# EAGLE design trinket-mcp23016 (EAGLE 9.6.2)
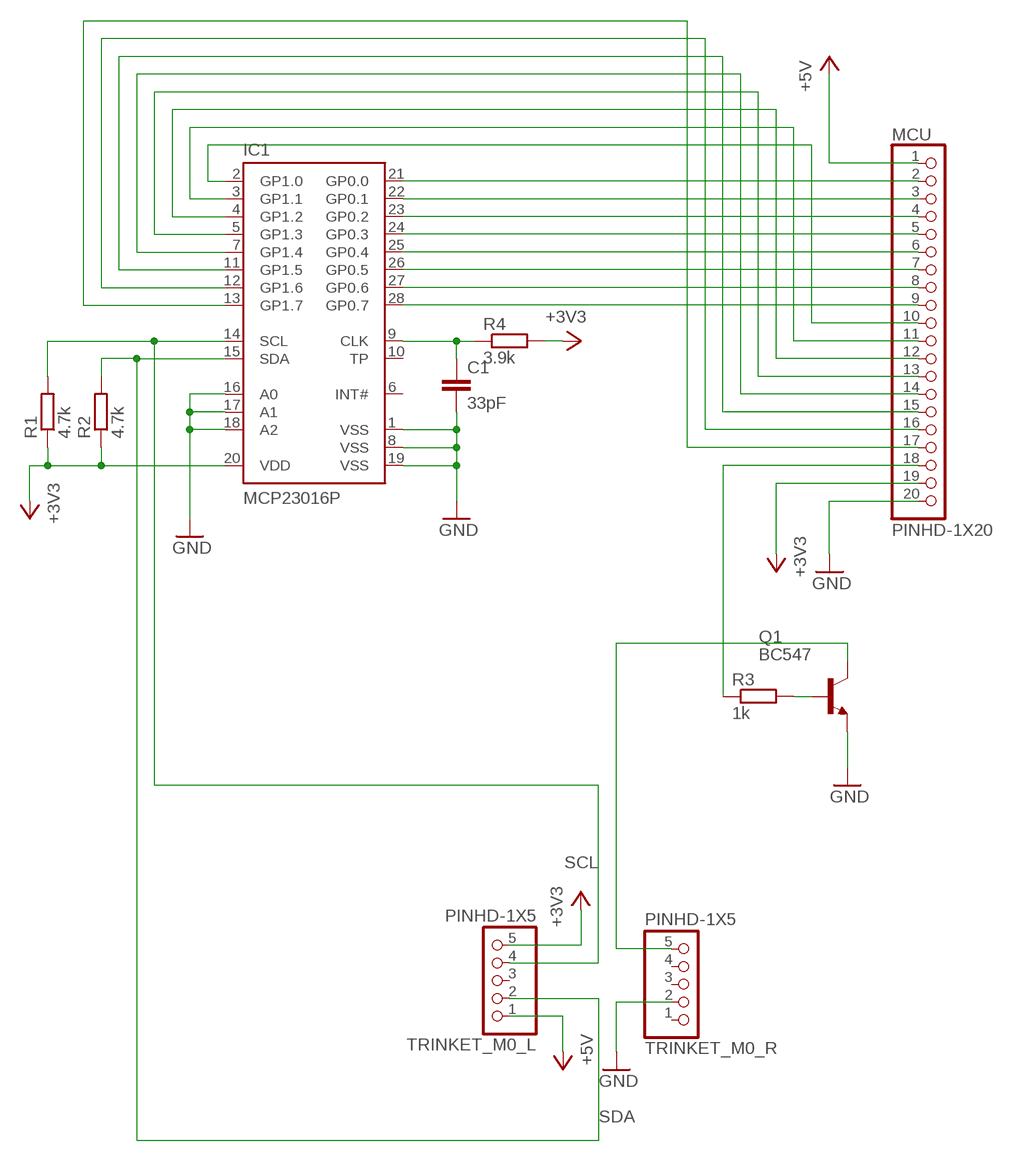
[diagram p0: schematic, sheet 1]

## Parts
C1  33pF  C-EU025-025X050  [C025-025X050]
IC1  MCP23016P  [DIL28-3]
MCU  PINHD-1X20  [1X20]
Q1  BC547  [TO92]
R1  4.7k  R-EU_0207/10  [0207/10]
R2  4.7k  R-EU_0207/10  [0207/10]
R3  1k  R-EU_0207/10  [0207/10]
R4  3.9k  R-EU_0207/10  [0207/10]
TRINKET_M0_L  PINHD-1X5  [1X05]
TRINKET_M0_R  PINHD-1X5  [1X05]

## Nets
+3V3: IC1.20(VDD) MCU.19 R1.1 R2.1 R4.2 TRINKET_M0_L.5
+5V: MCU.1 TRINKET_M0_L.1
GND: C1.2 IC1.1(VSS) IC1.8(VSS) IC1.16(A0) IC1.17(A1) IC1.18(A2) IC1.19(VSS) MCU.20 Q1.1(E) TRINKET_M0_R.2
N$1: IC1.21(GP0.0) MCU.2
N$2: IC1.22(GP0.1) MCU.3
N$3: IC1.23(GP0.2) MCU.4
N$4: IC1.24(GP0.3) MCU.5
N$5: IC1.25(GP0.4) MCU.6
N$6: IC1.26(GP0.5) MCU.7
N$7: IC1.27(GP0.6) MCU.8
N$8: IC1.28(GP0.7) MCU.9
N$9: IC1.2(GP1.0) MCU.10
N$10: IC1.3(GP1.1) MCU.11
N$11: IC1.4(GP1.2) MCU.12
N$12: IC1.5(GP1.3) MCU.13
N$13: IC1.7(GP1.4) MCU.14
N$14: IC1.11(GP1.5) MCU.15
N$15: IC1.12(GP1.6) MCU.16
N$16: IC1.13(GP1.7) MCU.17
N$17: Q1.2(B) R3.2
N$18: MCU.18 R3.1
N$19: Q1.3(C) TRINKET_M0_R.5
N$20: C1.1 IC1.9(CLK) R4.1
SCL: IC1.14(SCL) R1.2 TRINKET_M0_L.4
SDA: IC1.15(SDA) R2.2 TRINKET_M0_L.2
Unconnected: IC1.6(INT#) IC1.10(TP) TRINKET_M0_L.3 TRINKET_M0_R.1 TRINKET_M0_R.3 TRINKET_M0_R.4

## Library data of the parts
C1 = rcl:C-EU: CAPACITOR, European symbol; SPICEPREFIX: C
IC1 = microchip-dspic:MCP23016: 16-Bit I/O Expander with I2C Interface
MCU = Connector:PINHD-1X20: PIN HEADER; CATEGORY: CONNECTOR; SUB-CATEGORY: PIN-HEADER
Q1 = transistor-npn:BC547*: NPN Transistor
R1-R4 = rcl:R-EU_: RESISTOR, European symbol; SPICEPREFIX: R
TRINKET_M0_L TRINKET_M0_R = Connector:PINHD-1X5: PIN HEADER; CATEGORY: CONNECTOR; SUB-CATEGORY: PIN-HEADER

## Board
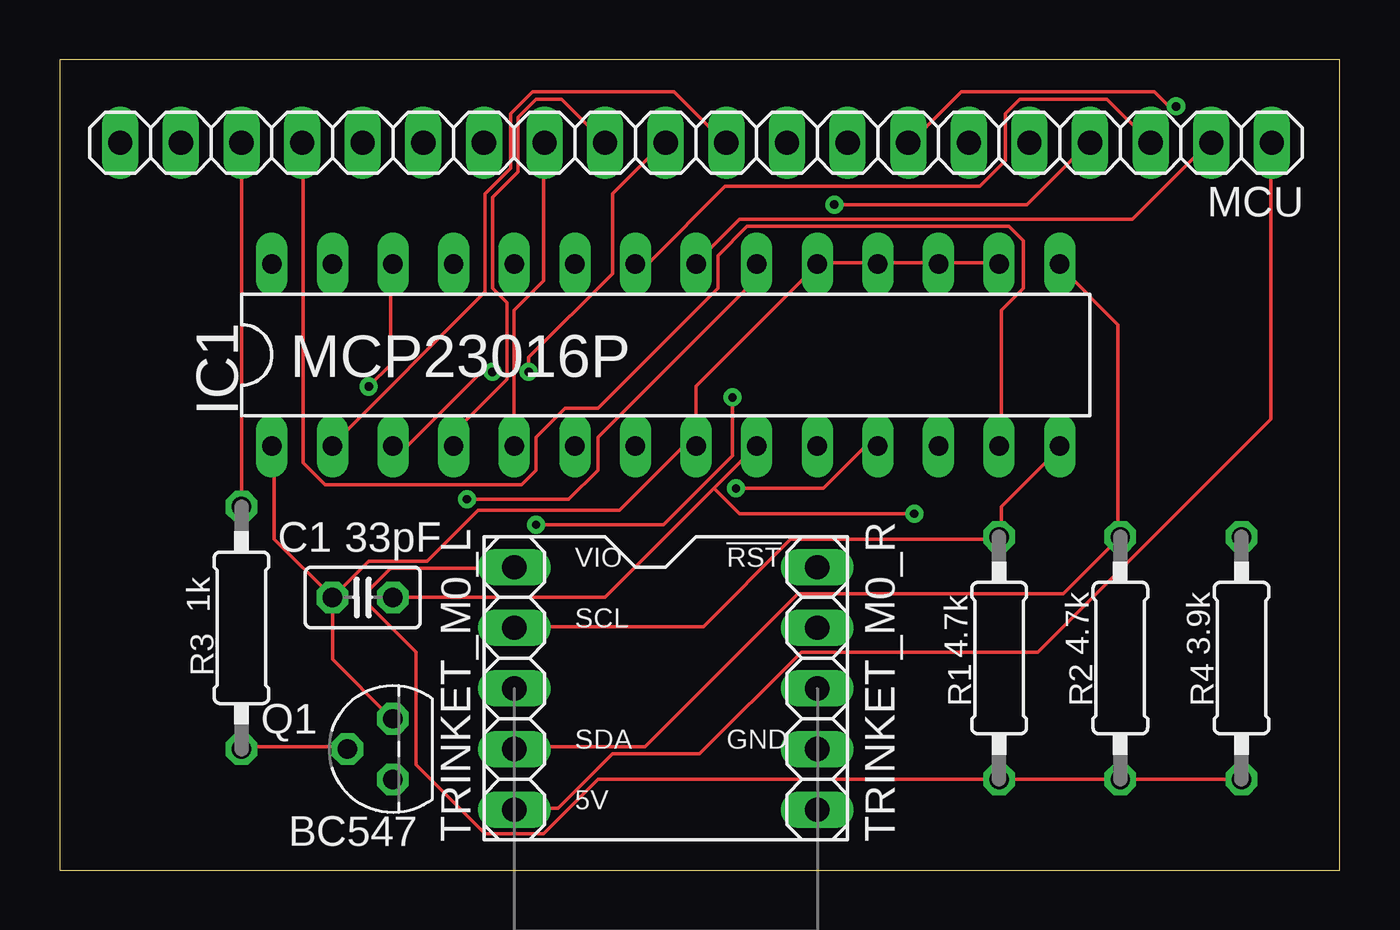
[diagram p1: board, top side]
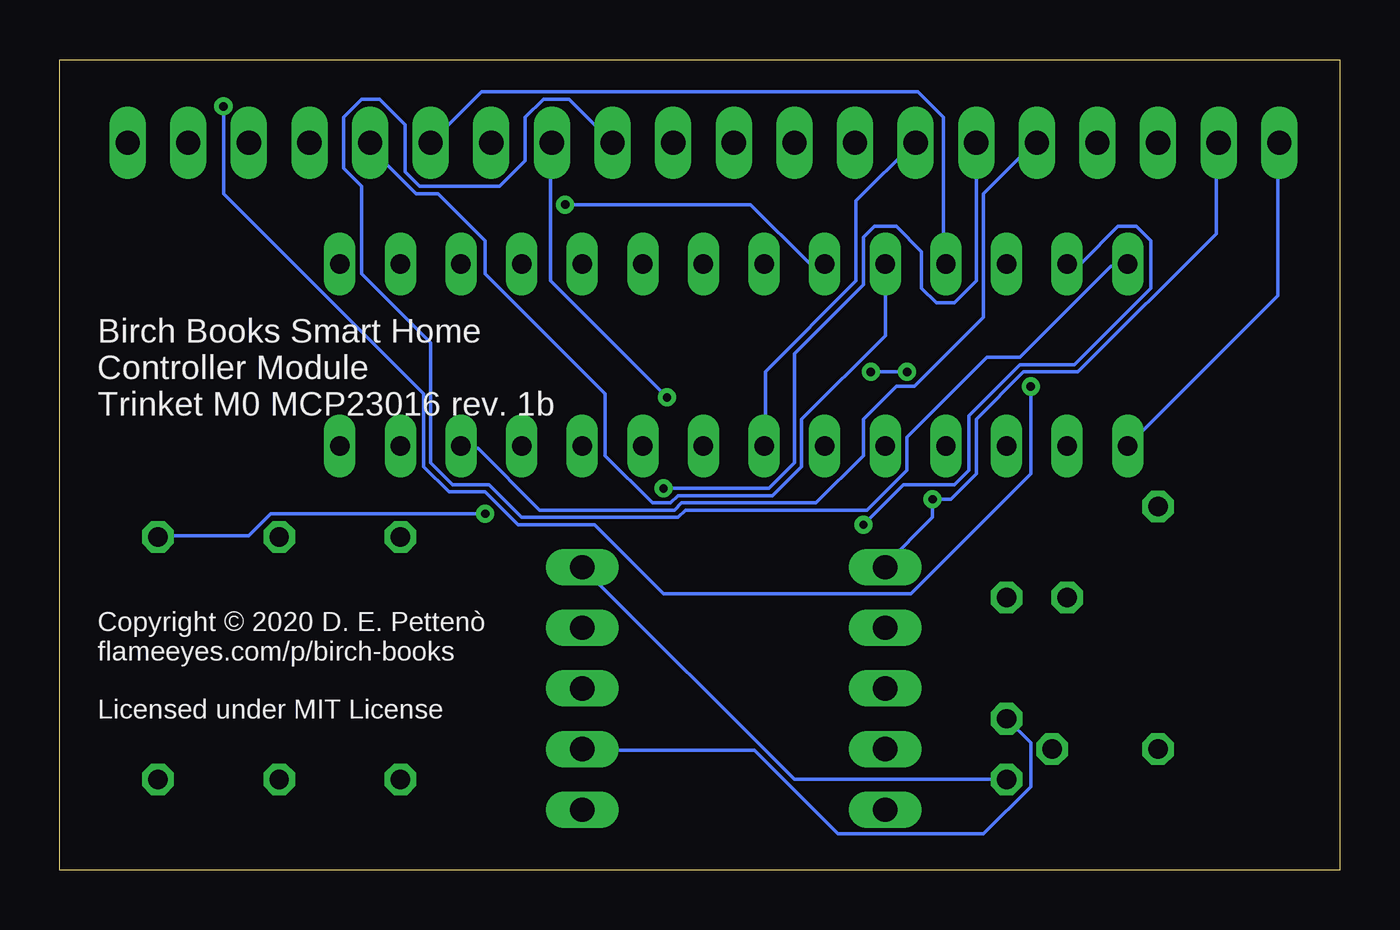
[diagram p2: board, bottom side, seen from below]

Size 53.65 x 33.96 mm. Coordinates in mm from the lower left corner, seen from the top.
Outline: 0,0 53.65,0 53.65,33.96 0,33.96 0,0
Copper layers (1*16): Top 0.035mm / dielectric 1.5mm / Bottom 0.035mm
Design rules "default": minimum track width 6mil, minimum drill 0.35mm, track to track 6mil, track to pad 6mil, pad to pad 6mil, via to via 6mil, smd to smd 6mil, copper to edge 40mil, drill to drill 6mil, minimum pad ring 10mil, minimum via ring 8mil, stop-mask expansion 4mil, vias tented up to drill 0mil, thermal gap 10mil

### Footprints (pad centres in the part's own frame; a part is rotated, then mirrored left to right if it is on the bottom)
C025-025X050 = drill 0.813 octagon: 1 -1.27,0; 2 1.27,0
DIL28-3 = drill 0.813 long: 1 -16.51,-3.81; 2 -13.97,-3.81; 3 -11.43,-3.81; 4 -8.89,-3.81; 5 -6.35,-3.81; 6 -3.81,-3.81; 7 -1.27,-3.81; 8 1.27,-3.81; 9 3.81,-3.81; 10 6.35,-3.81; 11 8.89,-3.81; 12 11.43,-3.81; 13 13.97,-3.81; 14 16.51,-3.81; 15 16.51,3.81; 16 13.97,3.81; 17 11.43,3.81; 18 8.89,3.81; 19 6.35,3.81; 20 3.81,3.81; 21 1.27,3.81; 22 -1.27,3.81; 23 -3.81,3.81; 24 -6.35,3.81; 25 -8.89,3.81; 26 -11.43,3.81; 27 -13.97,3.81; 28 -16.51,3.81
1X20 = drill 1.016 long: 1 -24.13,0; 2 -21.59,0; 3 -19.05,0; 4 -16.51,0; 5 -13.97,0; 6 -11.43,0; 7 -8.89,0; 8 -6.35,0; 9 -3.81,0; 10 -1.27,0; 11 1.27,0; 12 3.81,0; 13 6.35,0; 14 8.89,0; 15 11.43,0; 16 13.97,0; 17 16.51,0; 18 19.05,0; 19 21.59,0; 20 24.13,0
TO92 = drill 0.813 octagon: 1 1.27,0; 2 0,1.905; 3 -1.27,0
0207/10 = drill 0.813 octagon: 1 -5.08,0; 2 5.08,0
1X05 = drill 1.016 long: 1 -5.08,0; 2 -2.54,0; 3 0,0; 4 2.54,0; 5 5.08,0

### Placement (x,y rotation side)
C1  12.7,11.43 180 top
IC1  25.4,21.59 0 top
MCU  26.67,30.48 180 top
Q1  13.97,5.08 90 top
R1  39.37,8.89 90 top
R2  44.45,8.89 90 top
R3  7.62,10.16 270 top
R4  49.53,8.89 270 top
TRINKET_M0_L  19.05,7.62 90 top
TRINKET_M0_R  31.75,7.62 90 top

### Tracks (layer width: path | path; a pad name or v marks a point on that pad's centre or on a via)
+3V3  (via drill 0.35)
  Top 0.152: R4.2 R2.1 R1.1 22.55,3.81 20.27,1.52 17.83,1.52 14.94,4.42 14.94,9.14 12.95,11.12 12.95,11.73 13.87,12.65 19.05,12.65 TRINKET_M0_L.5 | v17.07,15.54 21.34,15.54 22.55,16.76 22.55,18.14 29.11,24.69 29.11,25.3 IC1.20
  Bottom 0.152: TRINKET_M0_L.5 19.05,12.8 17.07,14.78 v17.07,15.54 16.31,15.54 15.24,16.61 15.24,18.9 13.26,20.88 10.97,20.88 5.18,26.67 5.18,30.48 MCU.19
+5V
  Top 0.152: TRINKET_M0_L.1 19.05,2.59 20.88,2.59 23.16,4.88 26.82,4.88 31.09,9.14 41,9.14 50.75,18.9 50.75,30.48 MCU.1
GND
  Top 0.152: IC1.16 39.32,25.45 36.88,25.45 IC1.17 36.73,25.45 34.29,25.45 | 34.29,25.45 31.85,25.45 IC1.19 31.7,25.3 26.67,20.27 IC1.8 26.67,17.68 26.06,17.68 23.47,15.09 17.53,15.09 15.39,12.95 12.95,12.95 C1.2 | 34.29,25.45 IC1.18 | C1.2 11.43,8.84 13.87,6.4 Q1.1 | C1.2 8.99,13.87 8.99,17.68 IC1.1
  Bottom 0.152: IC1.1 2.59,24.08 2.59,30.48 MCU.20 | Q1.1 12.95,5.33 12.95,3.5 14.94,1.52 21.03,1.52 24.54,5.03 31.7,5.03 TRINKET_M0_R.2
N$1
  Top 0.152: IC1.21 26.67,25.45 28.5,27.28 44.96,27.28 48.16,30.48 MCU.2
N$2
  Top 0.152: MCU.3 43.89,32.31 40.23,32.31 39.62,31.7 39.62,29.72 38.56,28.65 27.89,28.65 24.69,25.45 24.23,25.45 IC1.22
N$3  (via drill 0.35)
  Top 0.152: v32.46,27.89 40.54,27.89 43.13,30.48 MCU.4
  Bottom 0.152: v32.46,27.89 24.69,27.89 22.25,25.45 21.64,25.45 IC1.23
N$4
  Bottom 0.152: IC1.24 19.05,22.4 22.55,18.9 22.55,16.92 23.77,15.7 27.74,15.7 28.04,15.39 28.8,15.39 30.79,17.37 30.79,19.96 35.81,24.99 35.81,26.36 37.8,28.35 38.71,28.35 40.54,30.18 40.54,30.48 MCU.5
N$5
  Bottom 0.152: MCU.6 35.97,32.61 17.68,32.61 16.61,31.55 16.61,25.45 IC1.25
N$6  (via drill 0.35)
  Top 0.152: v12.95,20.27 13.87,21.18 13.87,25.3 IC1.26 | v46.79,32 46.48,32 45.87,32.61 37.8,32.61 35.66,30.48 MCU.7
  Bottom 0.152: v12.95,20.27 12.95,16.61 17.98,11.58 28.35,11.58 31.24,14.48 34.44,14.48 35.81,15.85 37.34,15.85 38.41,16.92 38.41,19.96 46.79,28.35 v46.79,32
N$7  (via drill 0.35)
  Top 0.152: v19.96,14.48 25.3,14.48 28.19,17.37 v28.19,19.81
  Bottom 0.152: v19.96,14.48 18.29,16.15 16.15,16.15 15.54,16.76 15.54,19.05 13.41,21.18 11.12,21.18 7.92,24.38 7.92,26.36 8.53,26.98 9.3,26.98 10.82,25.45 11.43,25.45 IC1.27 | v28.19,19.81 33.07,24.69 33.07,30.48 MCU.8
N$8
  Bottom 0.152: MCU.9 32.31,32.31 33.38,32.31 34.14,31.55 34.14,29.72 35.2,28.65 38.56,28.65 39.17,29.26 39.17,31.24 40.23,32.31 41,32.31 41.76,31.55 41.76,29.41 41,28.65 41,24.99 38.1,22.1 38.1,17.07 37.19,16.15 35.66,16.15 34.29,14.78 27.74,14.78 27.43,15.09 19.81,15.09 18.14,16.76 18.14,18.14 14.78,21.49 13.41,21.49 9.6,25.3 8.99,25.3 IC1.28
N$9
  Top 0.152: IC1.2 11.43,17.83 17.83,24.23 17.83,28.35 18.9,29.41 18.9,31.7 19.81,32.61 25.76,32.61 27.89,30.48 MCU.10
N$10  (via drill 0.35)
  Top 0.152: v18.14,20.88 17.68,20.88 14.63,17.83 14.02,17.83 IC1.3 | v19.66,20.88 19.66,21.49 23.16,24.99 23.16,28.35 25.3,30.48 MCU.11
  Bottom 0.152: v19.66,20.88 v18.14,20.88
N$11
  Top 0.152: MCU.12 21.03,32.31 19.96,32.31 19.2,31.55 19.2,29.26 18.14,28.19 18.14,24.38 18.75,23.77 18.75,20.57 16.61,18.44 16.61,17.83 IC1.4
N$12
  Top 0.152: IC1.5 19.05,23.47 20.27,24.69 20.27,30.48 MCU.13
N$13
  Bottom 0.152: IC1.7 24.08,17.83 24.08,20.88 20.27,24.69 20.27,28.04 17.83,30.48 MCU.14
N$14  (via drill 0.35)
  Top 0.152: v28.35,16 32,16 33.68,17.68 34.29,17.68 IC1.11
  Bottom 0.152: v28.35,16 23.93,16 22.86,17.07 22.86,21.64 19.96,24.54 19.96,26.52 19.51,26.98 18.59,26.98 17.53,25.91 17.53,24.38 16.92,23.77 16.15,23.77 15.24,24.69 MCU.15
N$15
  Bottom 0.152: IC1.12 36.73,17.68 36.12,17.68 33.53,15.09 27.89,15.09 27.58,15.39 21.95,15.39 19.96,17.37 19.96,18.9 18.59,20.27 17.83,20.27 14.94,23.16 14.94,28.35 12.8,30.48 MCU.16
N$16
  Top 0.152: IC1.13 39.47,17.83 39.47,23.47 40.39,24.38 40.39,26.36 39.78,26.98 28.8,26.98 27.58,25.76 27.58,24.38 22.55,19.36 21.18,19.36 19.96,18.14 19.96,16.76 19.36,16.15 11.12,16.15 10.21,17.07 10.21,30.48 MCU.17
N$17
  Top 0.152: R3.2 7.62,5.18 12.04,5.18 Q1.2
N$18
  Top 0.152: MCU.18 R3.1
N$19
  Bottom 0.152: Q1.3 22.86,3.81 TRINKET_M0_R.5
N$20  (via drill 0.35)
  Top 0.152: C1.1 22.86,11.43 27.43,16 | IC1.9 27.43,16 | v35.81,14.94 28.5,14.94 27.43,16
  Bottom 0.152: v35.81,14.94 44.81,14.94 45.72,14.02 49.53,14.02 R4.1
SCL
  Top 0.152: IC1.14 41.91,17.68 39.47,15.24 39.47,14.02 R1.2 39.32,13.87 30.63,13.87 26.98,10.21 19.05,10.21 TRINKET_M0_L.4
SDA
  Top 0.152: IC1.15 41.91,25.3 44.35,22.86 44.35,14.02 R2.2 42.06,11.58 30.94,11.58 24.54,5.18 19.05,5.18 TRINKET_M0_L.2

### Text on the board
tPlace: VIO | !RST | SCL | SDA | GND | 5V
bPlace: Birch Books Smart Home / Controller Module / Trinket M0 MCP23016 rev. 1b | Copyright © 2020 D. E. Pettenò / flameeyes.com/p/birch-books / / Licensed under MIT License